# Altium schematic sheet dmpro16-pcb-v1-FPGA-Bank35.SchDoc
size A4; DocumentNumber: 8; SheetNumber: 8; SheetTotal: 17; SheetName: FPGA-Bank35
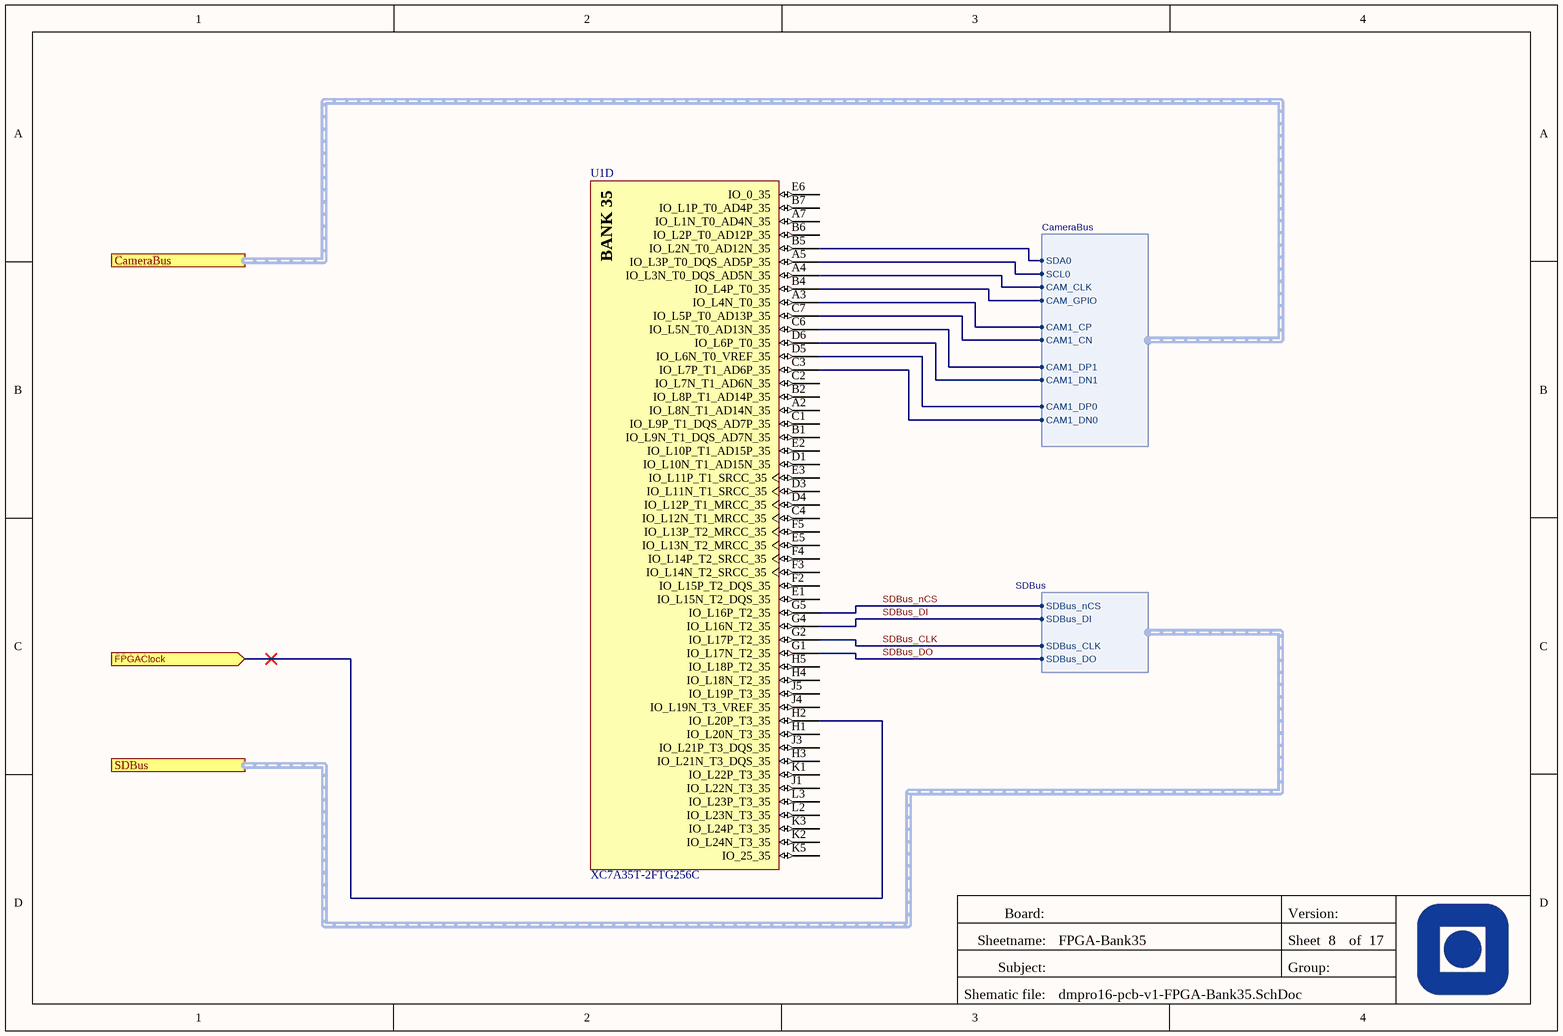
[diagram p0: dmpro16-pcb-v1-FPGA-Bank35.SchDoc]

## Parts
U1  XC7A35T-2FTG256C  [FTG256]  (part D of 8)

## Ports
CameraBus (harness CameraBus), FPGAClock (in), SDBus (harness SDBus)

## Harnesses
SDBus: SDBus_nCS, SDBus_DI, SDBus_CLK, SDBus_DO
CameraBus: SDA0, SCL0, CAM_CLK, CAM_GPIO, CAM1_CP, CAM1_CN, CAM1_DP1, CAM1_DN1, CAM1_DP0, CAM1_DN0

## Nets
FPGAClock: U1.H2(IO_L20P_T3_35) ; port FPGAClock
SDBus_CLK: U1.G2(IO_L17P_T2_35) ; port SDBus.SDBus_CLK
SDBus_DI: U1.G4(IO_L16N_T2_35) ; port SDBus.SDBus_DI
SDBus_DO: U1.G1(IO_L17N_T2_35) ; port SDBus.SDBus_DO
SDBus_nCS: U1.G5(IO_L16P_T2_35) ; port SDBus.SDBus_nCS
NetU1_A3: U1.A3(IO_L4N_T0_35) ; port CameraBus.CAM1_CP
NetU1_A4: U1.A4(IO_L3N_T0_DQS_AD5N_35) ; port CameraBus.CAM_CLK
NetU1_A5: U1.A5(IO_L3P_T0_DQS_AD5P_35) ; port CameraBus.SCL0
NetU1_B4: U1.B4(IO_L4P_T0_35) ; port CameraBus.CAM_GPIO
NetU1_B5: U1.B5(IO_L2N_T0_AD12N_35) ; port CameraBus.SDA0
NetU1_C3: U1.C3(IO_L7P_T1_AD6P_35) ; port CameraBus.CAM1_DN0
NetU1_C6: U1.C6(IO_L5N_T0_AD13N_35) ; port CameraBus.CAM1_DP1
NetU1_C7: U1.C7(IO_L5P_T0_AD13P_35) ; port CameraBus.CAM1_CN
NetU1_D5: U1.D5(IO_L6N_T0_VREF_35) ; port CameraBus.CAM1_DP0
NetU1_D6: U1.D6(IO_L6P_T0_35) ; port CameraBus.CAM1_DN1

Not connected (* = marked no-connect by the designer): U1 A2(IO_L8N_T1_AD14N_35) A7(IO_L1N_T0_AD4N_35) B1(IO_L9N_T1_DQS_AD7N_35) B2(IO_L8P_T1_AD14P_35) B6(IO_L2P_T0_AD12P_35) B7(IO_L1P_T0_AD4P_35) C1(IO_L9P_T1_DQS_AD7P_35) C2(IO_L7N_T1_AD6N_35) C4(IO_L12N_T1_MRCC_35) D1(IO_L10N_T1_AD15N_35) D3(IO_L11N_T1_SRCC_35) D4(IO_L12P_T1_MRCC_35) E1(IO_L15N_T2_DQS_35) E2(IO_L10P_T1_AD15P_35) E3(IO_L11P_T1_SRCC_35) E5(IO_L13N_T2_MRCC_35) E6(IO_0_35) F2(IO_L15P_T2_DQS_35) F3(IO_L14N_T2_SRCC_35) F4(IO_L14P_T2_SRCC_35) F5(IO_L13P_T2_MRCC_35) H1(IO_L20N_T3_35) H3(IO_L21N_T3_DQS_35) H4(IO_L18N_T2_35) H5(IO_L18P_T2_35) J1(IO_L22N_T3_35) J3(IO_L21P_T3_DQS_35) J4(IO_L19N_T3_VREF_35) J5(IO_L19P_T3_35) K1(IO_L22P_T3_35) K2(IO_L24N_T3_35) K3(IO_L24P_T3_35) K5(IO_25_35) L2(IO_L23N_T3_35) L3(IO_L23P_T3_35)

## Notes on the sheet
- Board:
- Version:
- Sheetname:
- Subject:
- Group:
- Sheet
- of
- Shematic file:
- (in symbol XC7A35T-2FTG256C, part D) BANK 35

## Library data of the parts
U1 = XC7A35T-2FTG256C: Artix-7 FPGA, 170 User I/Os, 0 GTP, 256-Ball BGA, Speed Grade 2, Commercial Grade, Pb-Free; Manufacturer: Xilinx; Total Block RAM: 1800 Kb; GTP: 0; Clock Mgmt Tiles (CMTs): 5; Logic Cells: 33280; Available User I/O: 170; Speed Grades: 2; DatasheetVersion: v1.15; PackageVersion: Rev. 1.11; PackageReference: FTG-256; PackageDescription: 256-Ball Wire-Bond Fine-Pitch Thin BGA, Body 17 x 17 mm, Pitch 1 mm; Maximum Distributed RAM: 400 Kb; Operating Temperature Range: Commercial; NexusDeviceID: XC7A35T-2FTG256C; Mounting Technology: Surface Mount; PartNumber: XC7A35T-2FTG256C; ComponentLink1Description: Manufacturer URL; ComponentLink1URL: http://www.xilinx.com/; ComponentLink2Description: Datasheet; ComponentLink2URL: http://www.xilinx.com/support/documentation/data_sheets/ds180_7Series_Overview.pdf; ComponentLink3Description: Package Specification; ComponentLink3URL: http://www.xilinx.com/support/documentation/user_guides/ug475_7Series_Pkg_Pinout.pdf; ComponentLink4Description: DC and Switching Characteristics; ComponentLink4URL: http://www.xilinx.com/support/documentation/data_sheets/ds181_Artix_7_Data_Sheet.pdf; ComponentLink5Description: Package File; ComponentLink5URL: http://www.xilinx.com/support/packagefiles/a7packages/xc7a200tsbg484pkg.txt; ComponentLink6Description: Packaging and Pinout; ComponentLink6URL: http://www.xilinx.com/support/documentation/user_guides/ug475_7Series_Pkg_Pinout.pdf